# Altium project PCB_Project.PrjPcb
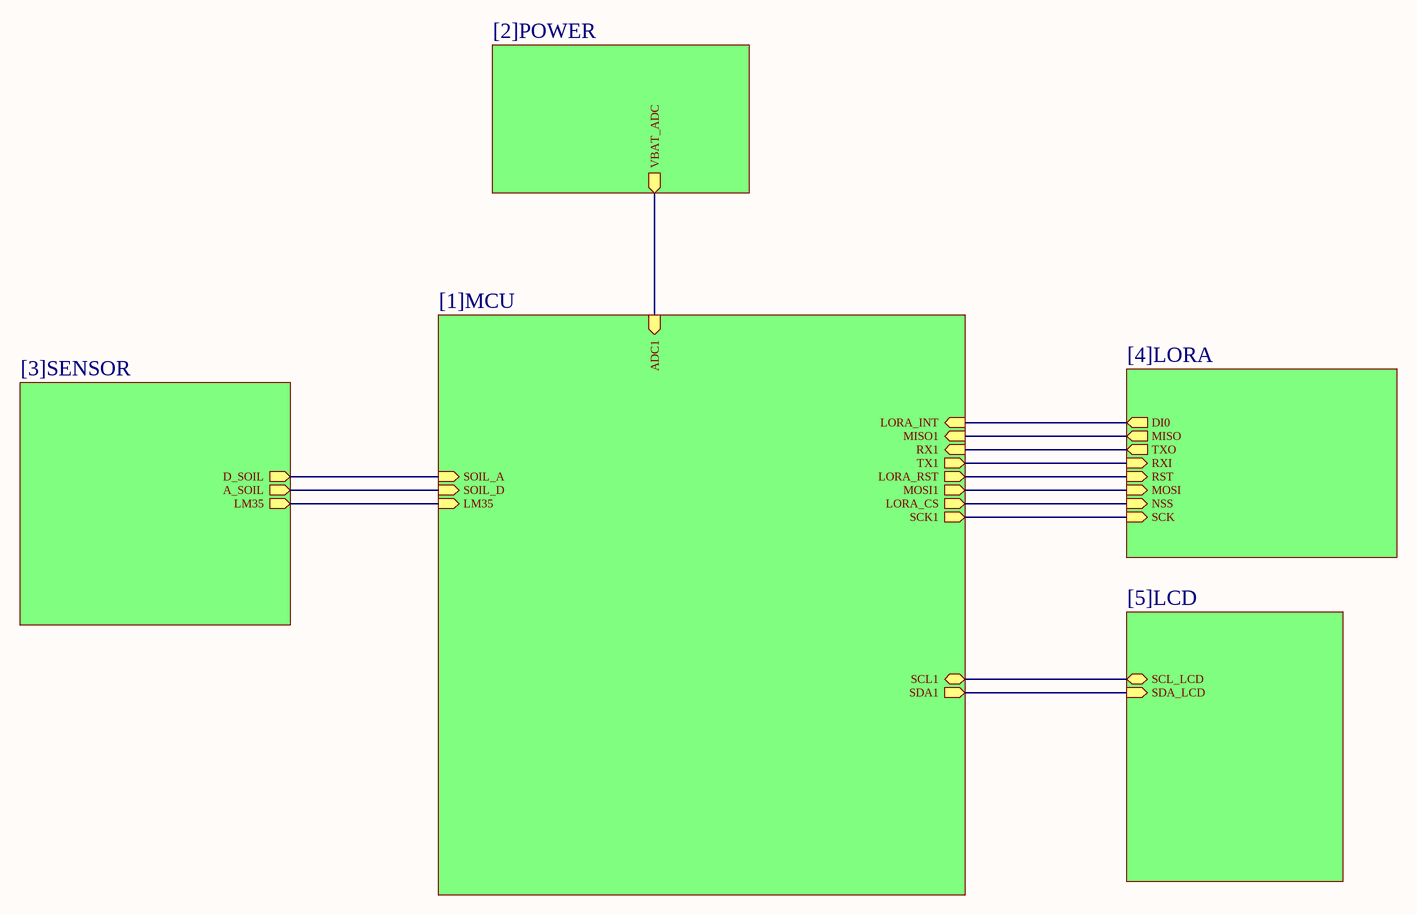
[diagram p0: Sheet1.SchDoc]
5 sheets, 44 parts. Net scope: hierarchical (ports join the sheet entries above them; power ports are global).
Board file: PCB1.PcbDoc
Sheets:
  Sheet1.SchDoc
    MCU = [1]MCU.SchDoc
    LCD = [5]LCD.SchDoc
    SENSOR = [3]SENSOR.SchDoc
    LORA = [4]LORA.SchDoc

## Sheet Sheet1.SchDoc
size C

### Sub-sheets
LCD = [5]LCD: SDA_LCD (in), SCL_LCD (bidir)
LORA = [4]LORA: DI0 (out), MISO (out), TXO (out), RXI (in), RST (in), MOSI (in), NSS (in), SCK (in)
MCU = [1]MCU: TX1 (out), LORA_INT (in), MOSI1 (out), SCK1 (out), MISO1 (in), LM35 (in), LORA_CS (out), LORA_RST (out), ADC1 (in), SOIL_D (in), SOIL_A (in), RX1 (in), SCL1 (bidir), SDA1 (out)
POWER = [2]POWER (file not in this document): VBAT_ADC (out)
SENSOR = [3]SENSOR: D_SOIL (out), A_SOIL (out), LM35 (out)

### Nets
NetIC2_7: sheet MCU/LM35, sheet SENSOR/LM35
NetJP2_3: sheet MCU/SOIL_D, sheet SENSOR/A_SOIL
NetJP2_4: sheet MCU/SOIL_A, sheet SENSOR/D_SOIL
NetJP3_1: sheet MCU/SCL1, sheet LCD/SCL_LCD
NetJP3_2: sheet MCU/SDA1, sheet LCD/SDA_LCD
NetU1_11: sheet MCU/ADC1, sheet POWER/VBAT_ADC
NetU1_14: sheet MCU/LORA_CS, sheet LORA/NSS
NetU1_30: sheet MCU/TX1, sheet LORA/RXI
NetU1_31: sheet MCU/RX1, sheet LORA/TXO
NetU1_39: sheet MCU/SCK1, sheet LORA/SCK
NetU1_40: sheet MCU/MISO1, sheet LORA/MISO
NetU1_41: sheet MCU/MOSI1, sheet LORA/MOSI
NetU1_42: sheet MCU/LORA_INT, sheet LORA/DI0
NetU1_43: sheet MCU/LORA_RST, sheet LORA/RST

## Sheet [1]MCU.SchDoc
size B
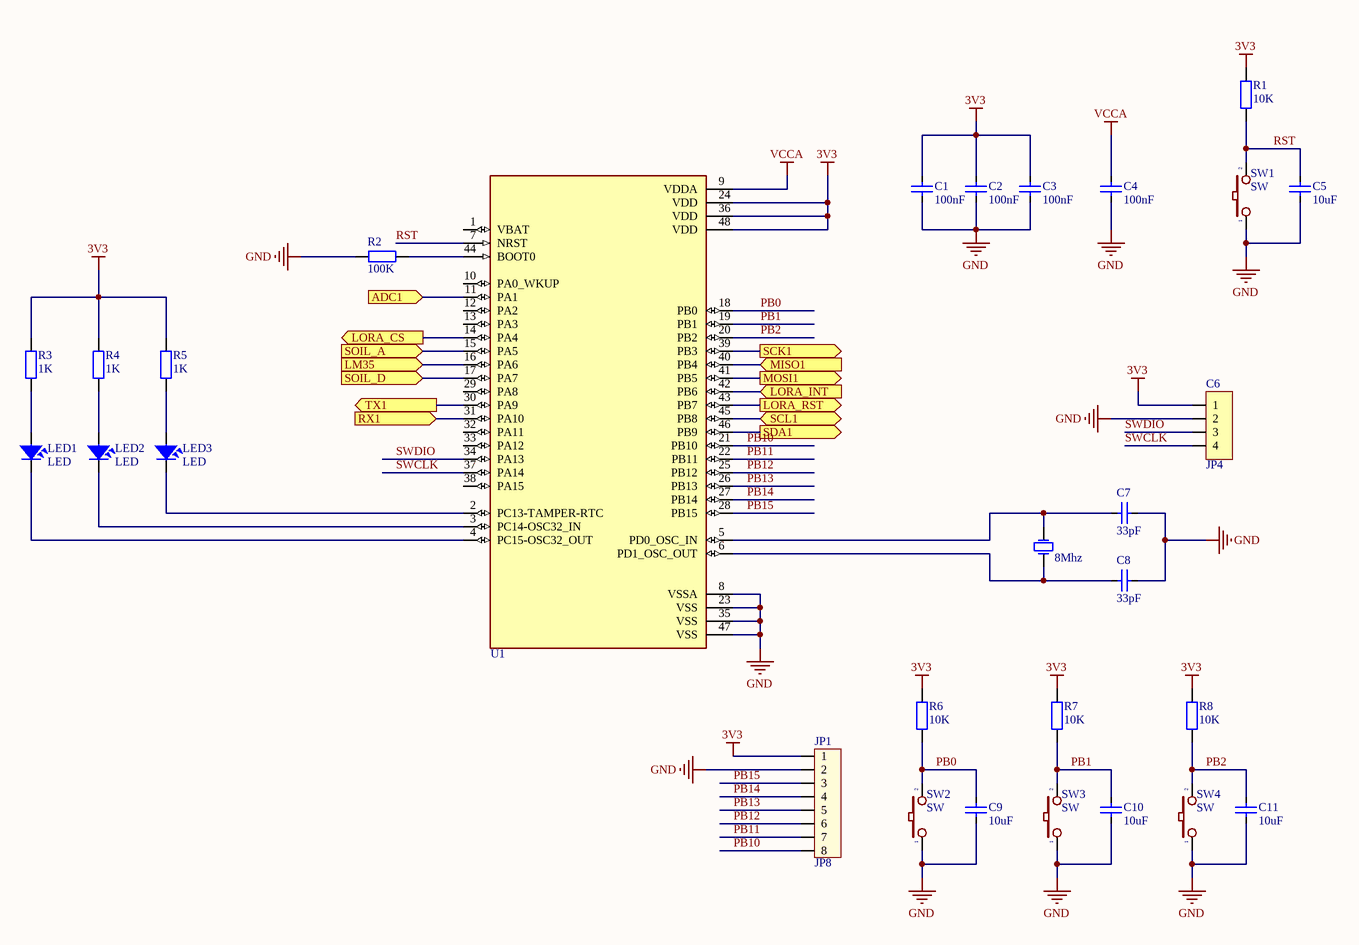
[diagram p1: [1]MCU.SchDoc]

### Parts
C1  100nF  [CAP_0805]
C2  100nF  [CAP_0805]
C3  100nF  [CAP_0805]
C4  100nF  [CAP_0805]
C5  10uF  [CAP_0805]
C6  JP4  [JP4-C1T]
C7  33pF  [CAP_0805]
C8  33pF  [CAP_0805]
C9  10uF  [CAP_0805]
C10  10uF  [CAP_0805]
C11  10uF  [CAP_0805]
JP1  JP8  [CON8]
LED1  LED  [LED-0805-Blue]
LED2  LED  [LED-0805-Blue]
LED3  LED  [LED-0805-Blue]
R1  10K  [RES-SMD-0805]
R2  100K  [RES_SMD_0805]
R3  1K  [RES_SMD_0805]
R4  1K  [RES_SMD_0805]
R5  1K  [RES_SMD_0805]
R6  10K  [RES-SMD-0805]
R7  10K  [RES-SMD-0805]
R8  10K  [RES-SMD-0805]
SW1  SW  [SW2]
SW2  SW  [SW2]
SW3  SW  [SW2]
SW4  SW  [SW2]
U1  STM32  [LQFP 48]  (value not drawn)
Y1  8Mhz  [XTAL]

### Ports
ADC1 (in), LM35 (in), LORA_CS (out), LORA_INT (in), LORA_RST (out), MISO1 (in), MOSI1 (out), RX1 (in), SCK1 (out), SCL1 (bidir), SDA1 (out), SOIL_A (in), SOIL_D (in), TX1 (out)

### Nets
3V3: C1.2 C2.2 C3.2 C6.1 JP1.1 R1.1 R3.1 R4.1 R5.1 R6.1 R7.1 R8.1 U1.24(VDD) U1.36(VDD) U1.48(VDD)
GND: C1.1 C2.1 C3.1 C4.1 C5.1 C6.2 C7.2 C8.2 C9.1 C10.1 C11.1 JP1.2 R2.2 SW1.1 SW2.1 SW3.1 SW4.1 U1.8(VSSA) U1.23(VSS) U1.35(VSS) U1.47(VSS)
VCCA: C4.2 U1.9(VDDA)
PB0: C9.2 R6.2 SW2.2 U1.18(PB0)
PB1: C10.2 R7.2 SW3.2 U1.19(PB1)
PB2: C11.2 R8.2 SW4.2 U1.20(PB2)
PB10: JP1.8 U1.21(PB10)
PB11: JP1.7 U1.22(PB11)
PB12: JP1.6 U1.25(PB12)
PB13: JP1.5 U1.26(PB13)
PB14: JP1.4 U1.27(PB14)
PB15: JP1.3 U1.28(PB15)
RST: C5.2 R1.2 SW1.2 U1.7(NRST)
SWCLK: C6.4 U1.37(PA14)
SWDIO: C6.3 U1.34(PA13)
NetC7_1: C7.1 U1.5(PD0_OSC_IN) Y1.2(OSC2)
NetC8_1: C8.1 U1.6(PD1_OSC_OUT) Y1.1(OSC1)
NetIC2_7: U1.16(PA6) ; port LM35
NetJP2_3: U1.17(PA7) ; port SOIL_D
NetJP2_4: U1.15(PA5) ; port SOIL_A
NetJP3_1: U1.45(PB8) ; port SCL1
NetJP3_2: U1.46(PB9) ; port SDA1
NetLED1_1: LED1.1 R3.2
NetLED1_2: LED1.2 U1.4(PC15-OSC32_OUT)
NetLED2_1: LED2.1 R4.2
NetLED2_2: LED2.2 U1.3(PC14-OSC32_IN)
NetLED3_1: LED3.1 R5.2
NetLED3_2: LED3.2 U1.2(PC13-TAMPER-RTC)
NetR2_1: R2.1 U1.44(BOOT0)
NetU1_11: U1.11(PA1) ; port ADC1
NetU1_14: U1.14(PA4) ; port LORA_CS
NetU1_30: U1.30(PA9) ; port TX1
NetU1_31: U1.31(PA10) ; port RX1
NetU1_39: U1.39(PB3) ; port SCK1
NetU1_40: U1.40(PB4) ; port MISO1
NetU1_41: U1.41(PB5) ; port MOSI1
NetU1_42: U1.42(PB6) ; port LORA_INT
NetU1_43: U1.43(PB7) ; port LORA_RST

Not connected (* = marked no-connect by the designer): U1 1(VBAT) 10(PA0_WKUP) 12(PA2) 13(PA3) 29(PA8) 32(PA11) 33(PA12) 38(PA15)

### Library data of the parts
C1-C5 C7-C11 = CapSMD: Capacitor; Value: 33p; Published: 8-Jun-2000; LatestRevisionDate: 17-Jul-2002; LatestRevisionNote: Re-released for DXP Platform.; PackageReference: RAD-0.3; Publisher: Altium Limited
C6 = JP4: WR-PHD 2.54 mm Angled Socket Header; Manufacturer: W¨¹rth Elektronik eiSos GmbH; partNo: 613004143121; ComponentLink1 Description: Manufacturer; ComponentLink2 Description: Datasheet; NoPins: 04; Created Date: 29 March 2013; ComponentLink1URL: http://www.we-online.com; ComponentLink2URL: http://katalog.we-online.de/em/datasheet/6130xx143121.pdf; Created by: Karrer Zheng
JP1 = Con8: Connector 8; Value: Connector 8
LED1-LED3 = LED: LED Single colour Green and Red; Value: LED 3 ly Single Colour
R1-R8 = Resistor - SMD: Resistor SMD; Manufacturer: Generic Components; Class: Passive; Published: 08/06/2000; Publisher: Altium Hobart Technology Centre
SW1-SW4 = SW2: Switch button 2 pin; Value: SW chip 2 pin
U1 = STM32F103C8T6: STM32 ARM-based 32-bit MCU with 64 Kbytes Flash, 64-pin LQFP, Industrial Temperature
Y1 = XTAL: Crystal Oscillator; Published: 8-Jun-2000; LatestRevisionDate: 17-Jul-2002; LatestRevisionNote: Re-released for DXP Platform.; PackageReference: R38; Publisher: Altium Limited

## Sheet [5]LCD.SchDoc
size A
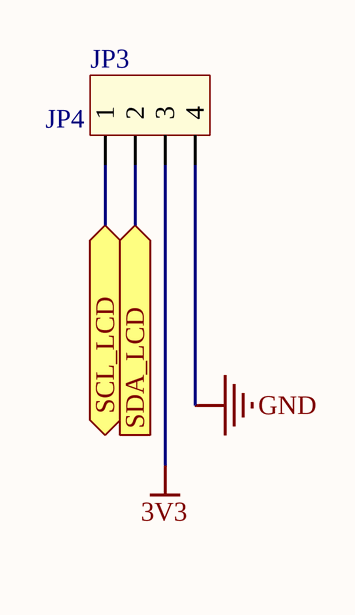
[diagram p2: [5]LCD.SchDoc]

### Parts
JP3  JP4  [CON4]

### Ports
SCL_LCD (bidir), SDA_LCD (in)

### Nets
3V3: JP3.3
GND: JP3.4
NetJP3_1: JP3.1 ; port SCL_LCD
NetJP3_2: JP3.2 ; port SDA_LCD

### Library data of the parts
JP3 = Con4: Connector 4; Value: Connector 4

## Sheet [3]SENSOR.SchDoc
size A
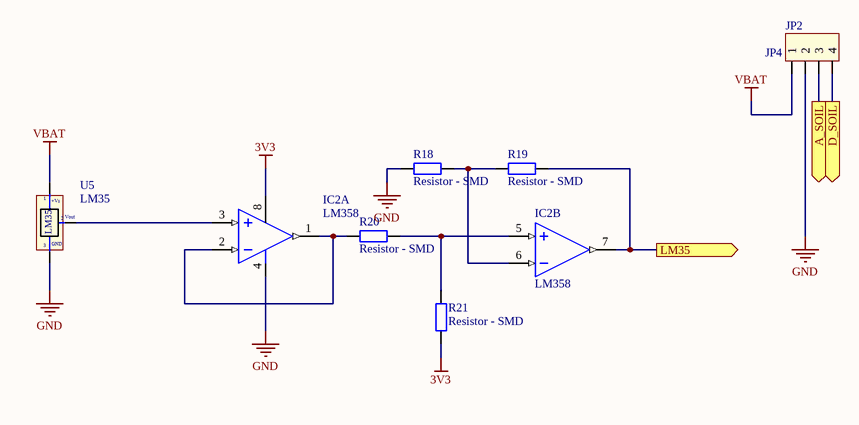
[diagram p3: [3]SENSOR.SchDoc]

### Parts
IC2  LM358  [DIP8/W0.3]  (parts A,B of 2)
JP2  JP4  [CON4]
R18  Resistor - SMD  [RES_SMD_0805]
R19  Resistor - SMD  [RES_SMD_0805]
R20  Resistor - SMD  [RES_SMD_0805]
R21  Resistor - SMD  [RES_SMD_0805]
U5  LM35  [QTO-92]

### Ports
A_SOIL (out), D_SOIL (out), LM35 (out)

### Nets
3V3: IC2.8(+V) R21.2
GND: IC2.4(-V) JP2.2 R18.1 U5.3(-)
VBAT: JP2.1 U5.1(+Vs)
NetIC2_1: IC2.1(OUT) IC2.2(IN-) R20.2
NetIC2_3: IC2.3(IN+) U5.2(Vout)
NetIC2_5: IC2.5(IN+) R20.1 R21.1
NetIC2_6: IC2.6(IN-) R18.2 R19.1
NetIC2_7: IC2.7(OUT) R19.2 ; port LM35
NetJP2_3: JP2.3 ; port A_SOIL
NetJP2_4: JP2.4 ; port D_SOIL

### Notes on the sheet
- (in symbol LM35) GND

### Library data of the parts
IC2 = LM358: Low-Power Dual Operational Amplifier; Value: LM358
JP2 = Con4: Connector 4; Value: Connector 4
R18-R21 = Resistor - SMD: as R1 on sheet [1]MCU; Published: 08/06/2000; Publisher: Altium Hobart Technology Centre
U5 = LM35: Teminal; Value: LM35

## Sheet [4]LORA.SchDoc
size A
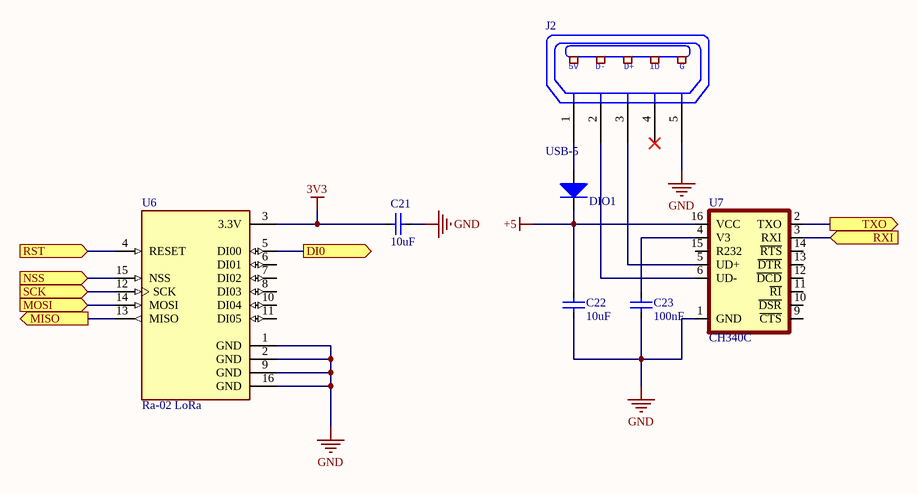
[diagram p4: [4]LORA.SchDoc]

### Parts
C21  10uF  [CAP_0805]
C22  10uF  [CAP_0805]
C23  100nF  [CAP_0805]
DIO1  Diode SMD  [DIO-SMD-106]  (value not drawn)
J2  USB-5  [USB-M1]
U6  Ra-02 LoRa  [Ra-02]
U7  CH340C  [SOP-16]

### Ports
DI0 (out), MISO (out), MOSI (in), NSS (in), RST (in), RXI (in), SCK (in), TXO (out)

### Nets
3V3: C21.1 U6.3(3.3V)
+5: C22.2 DIO1.2(K) U7.16(VCC)
GND: C21.2 C22.1 C23.1 J2.5(P5) U6.1(GND) U6.2(GND) U6.9(GND) U6.16(GND) U7.1(GND)
NetC23_2: C23.2 U7.4(V3)
NetDIO1_1: DIO1.1(A) J2.1(P1)
NetJ2_2: J2.2(P2) U7.6(UD-)
NetJ2_3: J2.3(P3) U7.5(UD+)
NetU1_14: U6.15(NSS) ; port NSS
NetU1_30: U7.3(RXI) ; port RXI
NetU1_31: U7.2(TXO) ; port TXO
NetU1_39: U6.12(SCK) ; port SCK
NetU1_40: U6.13(MISO) ; port MISO
NetU1_41: U6.14(MOSI) ; port MOSI
NetU1_42: U6.5(DI00) ; port DI0
NetU1_43: U6.4(RESET) ; port RST

Not connected (* = marked no-connect by the designer): J2 4(P4)*; U6 6(DI01) 7(DI02) 8(DI03) 10(DI04) 11(DI05); U7 9(~{CTS}) 10(~{DSR}) 11(~{RI}) 12(~{DCD}) 13(~{DTR}) 14(~{RTS}) 15(R232)

### Notes on the sheet
- (in symbol USB-5) 5V; D-; D+; ID; G

### Library data of the parts
C21-C23 = CapSMD: Capacitor; Value: 33p; Published: 8-Jun-2000; LatestRevisionDate: 17-Jul-2002; LatestRevisionNote: Re-released for DXP Platform.; PackageReference: RAD-0.3; Publisher: Altium Limited
DIO1 = Diode SMD: Default Diode; Code - JEDEC: DO-214-AB; Value: 1N5007; Published: 8-Jun-2000; Revision: July-2002: Re-released for DXP Platform.; Publisher: Altium Limited
J2 = USB-5: Manufacturer: FCI; Manufacturer Part Number: 10118193-0001LF; Connector Type: USB - micro B; Number of Contacts: 5; Gender: Receptacle; Specifications: USB 2.0; .Creator: MM; .Checked PCB: RF; Supplier 1: Digi-Key; RoHS: RoHS Compliant; Category: Connectors, Interconnects; Stock 1: 28642; Pricing 1: 1=0.46, 10=0.433, 25=0.3712, 50=0.3156, 100=0.3032, 250=0.27224, 500=0.25988 (USD); Packaging: Cut Tape (CT); Mounting Type: Surface Mount, Right Angle, Horizontal; Features: Shielded, Solder Retention; Ingress Protection: -; ComponentLink1URL: http://portal.fciconnect.com/Comergent//fci/drawing/10118193.pdf; ComponentLink1Description: http://portal.fciconnect.com/Comergent//fci/drawing/10118193.pdf; Supplier Part Number 1: 609-4616-1-ND; .Checked SCH: MM
U6 = Ra-02 LoRa: LoRa Module Ra-02
U7 = CH340C: USB to serial chip CH340; MF: WCH; Package: Package; Check_prices: https://www.snapeda.com/parts/CH340C/WCH/view-part/5428851/?ref=eda; Value: *; Price: None; MP: CH340C; Availability: Unavailable; SnapEDA_Link: https://www.snapeda.com/parts/CH340C/WCH/view-part/5428851/?ref=snap

## Nets that join several sheets
3V3: [1]MCU (15 pins), [5]LCD (JP3.3), [3]SENSOR (IC2.8 R21.2), [4]LORA (C21.1 U6.3)
GND: [1]MCU (21 pins), [5]LCD (JP3.4), [3]SENSOR (IC2.4 JP2.2 R18.1 U5.3), [4]LORA (9 pins)
NetIC2_7: [1]MCU (U1.16), [3]SENSOR (IC2.7 R19.2)
NetJP2_3: [1]MCU (U1.17), [3]SENSOR (JP2.3)
NetJP2_4: [1]MCU (U1.15), [3]SENSOR (JP2.4)
NetJP3_1: [1]MCU (U1.45), [5]LCD (JP3.1)
NetJP3_2: [1]MCU (U1.46), [5]LCD (JP3.2)
NetU1_14: [1]MCU (U1.14), [4]LORA (U6.15)
NetU1_30: [1]MCU (U1.30), [4]LORA (U7.3)
NetU1_31: [1]MCU (U1.31), [4]LORA (U7.2)
NetU1_39: [1]MCU (U1.39), [4]LORA (U6.12)
NetU1_40: [1]MCU (U1.40), [4]LORA (U6.13)
NetU1_41: [1]MCU (U1.41), [4]LORA (U6.14)
NetU1_42: [1]MCU (U1.42), [4]LORA (U6.5)
NetU1_43: [1]MCU (U1.43), [4]LORA (U6.4)